# Altium project ADS131A04.PrjPcb
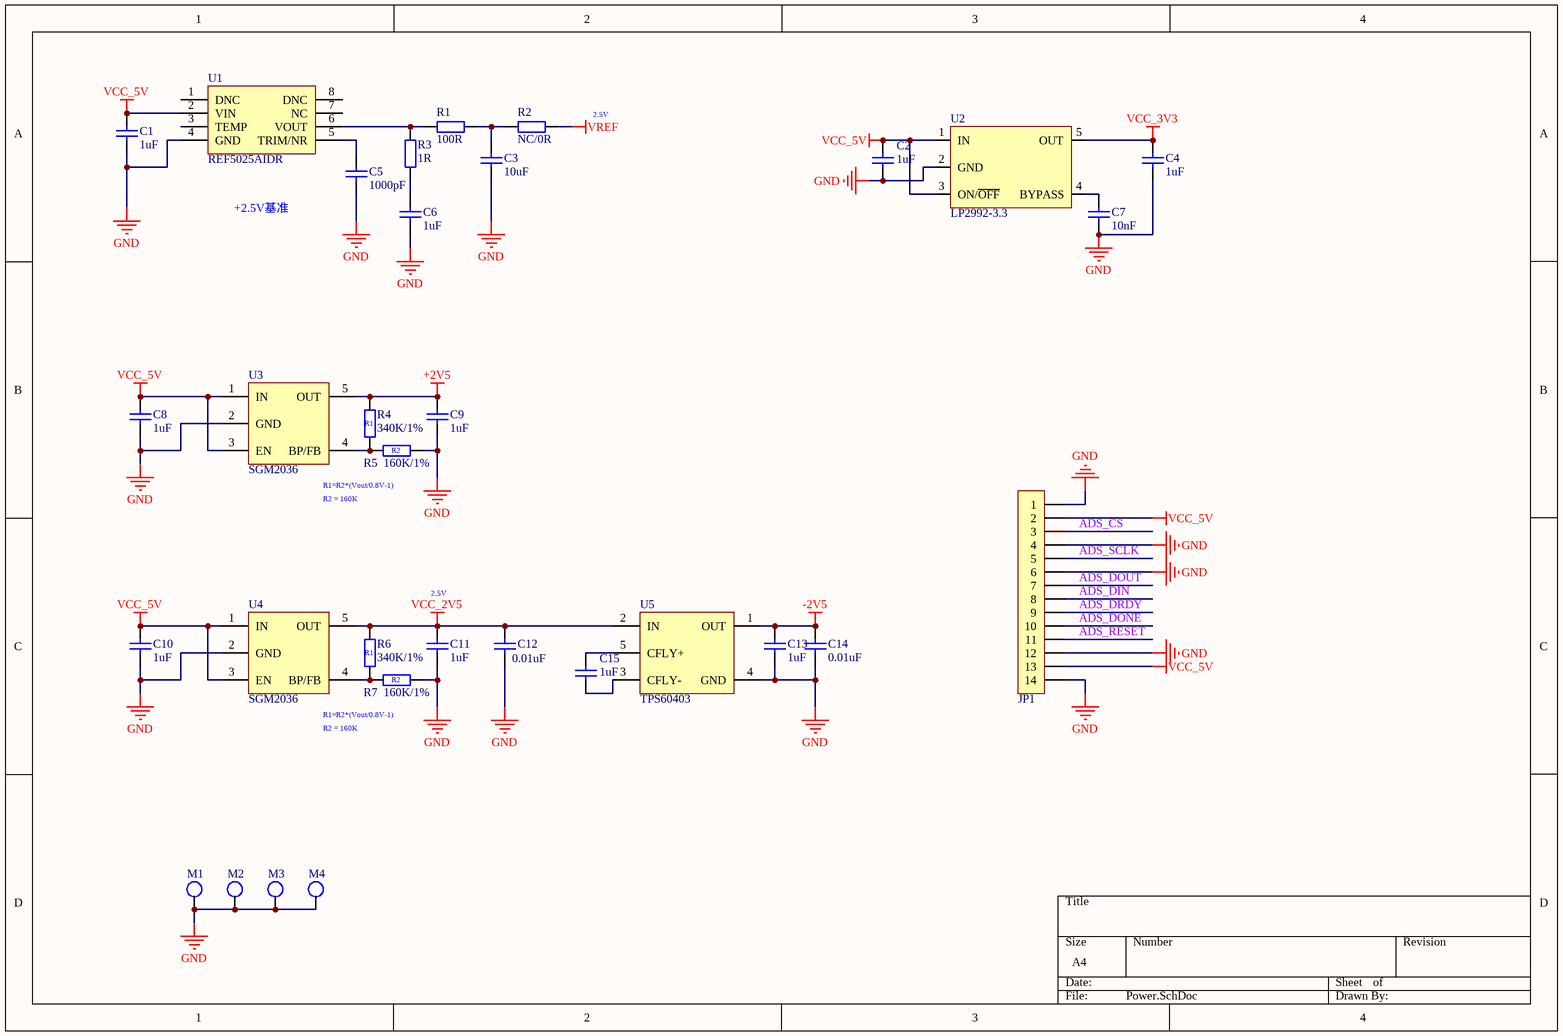
[diagram p0: Power.SchDoc]
2 sheets, 74 parts. Net scope: global (net labels, ports and power ports of the same name join across sheets).
Board files: ADS131A04.PcbDoc, 板框.PcbDoc
Sheets:
  Power.SchDoc
  ADS131A04.SchDoc

## Sheet Power.SchDoc
size A4; SheetNumber: 1; SheetTotal: 2

### Parts
C1  1uF  [C0402_L]
C2  1uF  [C0402_L]
C3  10uF  [C0603_L]
C4  1uF  [C0402_L]
C5  1000pF  [C0402_L]
C6  1uF  [C0402_L]
C7  10nF  [C0402_L]
C8  1uF  [C0402_L]
C9  1uF  [C0402_L]
C10  1uF  [C0402_L]
C11  1uF  [C0402_L]
C12  0.01uF  [C0402_L]
C13  1uF  [C0402_L]
C14  0.01uF  [C0402_L]
C15  1uF  [C0402_L]
JP1  HDR-1X14  [FPC0.5-WT-14P]  (value not drawn)
M1  M2  [M2]  (value not drawn)
M2  M2  [M2]  (value not drawn)
M3  M2  [M2]  (value not drawn)
M4  M2  [M2]  (value not drawn)
R1  100R  [R0402_L]
R2  NC/0R  [R0402_L]
R3  1R  [R0402_L]
R4  340K/1%  [R0402_L]
R5  160K/1%  [R0402_L]
R6  340K/1%  [R0402_L]
R7  160K/1%  [R0402_L]
U1  REF5025AIDR  [SOIC-8L]
U2  LP2992-3.3  [SOT23-5L]
U3  SGM2036  [SOT23-5L]
U4  SGM2036  [SOT23-5L]
U5  TPS60403  [SOT23-5L]

### Nets
+2V5: C9.2 R4.2 U3.5(OUT)
-2V5: C13.2 C14.2 U5.1(OUT)
GND: C1.1 C2.1 C3.1 C4.1 C5.1 C6.1 C7.1 C8.1 C9.1 C10.1 C11.1 C12.1 C13.1 C14.1 JP1.1 JP1.4 JP1.6 JP1.12 JP1.14 M1.1 M2.1 M3.1 M4.1 R5.2 R7.2 U1.4(GND) U2.2(GND) U3.2(GND) U4.2(GND) U5.4(GND)
VCC_2V5: C11.2 C12.2 R6.2 U4.5(OUT) U5.2(IN)
VCC_3V3: C4.2 U2.5(OUT)
VCC_5V: C1.2 C2.2 C8.2 C10.2 JP1.2 JP1.13 U1.2(VIN) U2.1(IN) U2.3(ON/~{OFF}) U3.1(IN) U3.3(EN) U4.1(IN) U4.3(EN)
VREF: R2.2
ADS_CS: JP1.3
ADS_DIN: JP1.8
ADS_DONE: JP1.10
ADS_DOUT: JP1.7
ADS_DRDY: JP1.9
ADS_RESET: JP1.11
ADS_SCLK: JP1.5
NetC3_2: C3.2 R1.2 R2.1
NetC5_2: C5.2 U1.5(TRIM/NR)
NetC6_2: C6.2 R3.1
NetC7_2: C7.2 U2.4(BYPASS)
NetC15_1: C15.1 U5.3(CFLY-)
NetC15_2: C15.2 U5.5(CFLY+)
NetR1_1: R1.1 R3.2 U1.6(VOUT)
NetR4_1: R4.1 R5.1 U3.4(BP/FB)
NetR6_1: R6.1 R7.1 U4.4(BP/FB)

Not connected (* = marked no-connect by the designer): U1 1(DNC) 3(TEMP) 7(NC) 8(DNC)

### Notes on the sheet
- (near R2) 2.5V
- +2.5V基准
- (near R4) R1
- (near R5) R2
- R1=R2*(Vout/0.8V-1)
- R2 = 160K
- (near R6) R1
- (near C11) 2.5V
- (near R7) R2

### Library data of the parts
C1-C15 = C: 贴片电容; BOM名称: 无极性贴片电容; 联系卖家，免费查找封装: 唯一出售店铺网址https://shop463601444.taobao.com
JP1 = Header 14: 14P接插件; 封装库来自淘宝卖家 ID：黄晶宝石: 其他店铺购入均为盗版假冒封装库; 联系卖家，免费查找封装: 唯一出售店铺网址https://shop463601444.taobao.com; BOM名称: 14P接插件
M1-M4 = M2系列: M2孔支撑柱
R1-R7 = R: 贴片电阻; 联系卖家，免费查找封装: 唯一出售店铺网址https://shop463601444.taobao.com; BOM名称: 贴片电阻
U1 = REF5025AIDR: 3uVpp/V噪声 3ppm/℃漂移 电压基准 0.05%
U2 = LP2992
U3 U4 = SGM2036: 可调LDO
U5 = TPS6040x: 非稳压60mA电荷泵电压逆变器

## Sheet ADS131A04.SchDoc
size A4; SheetNumber: 2; SheetTotal: 2
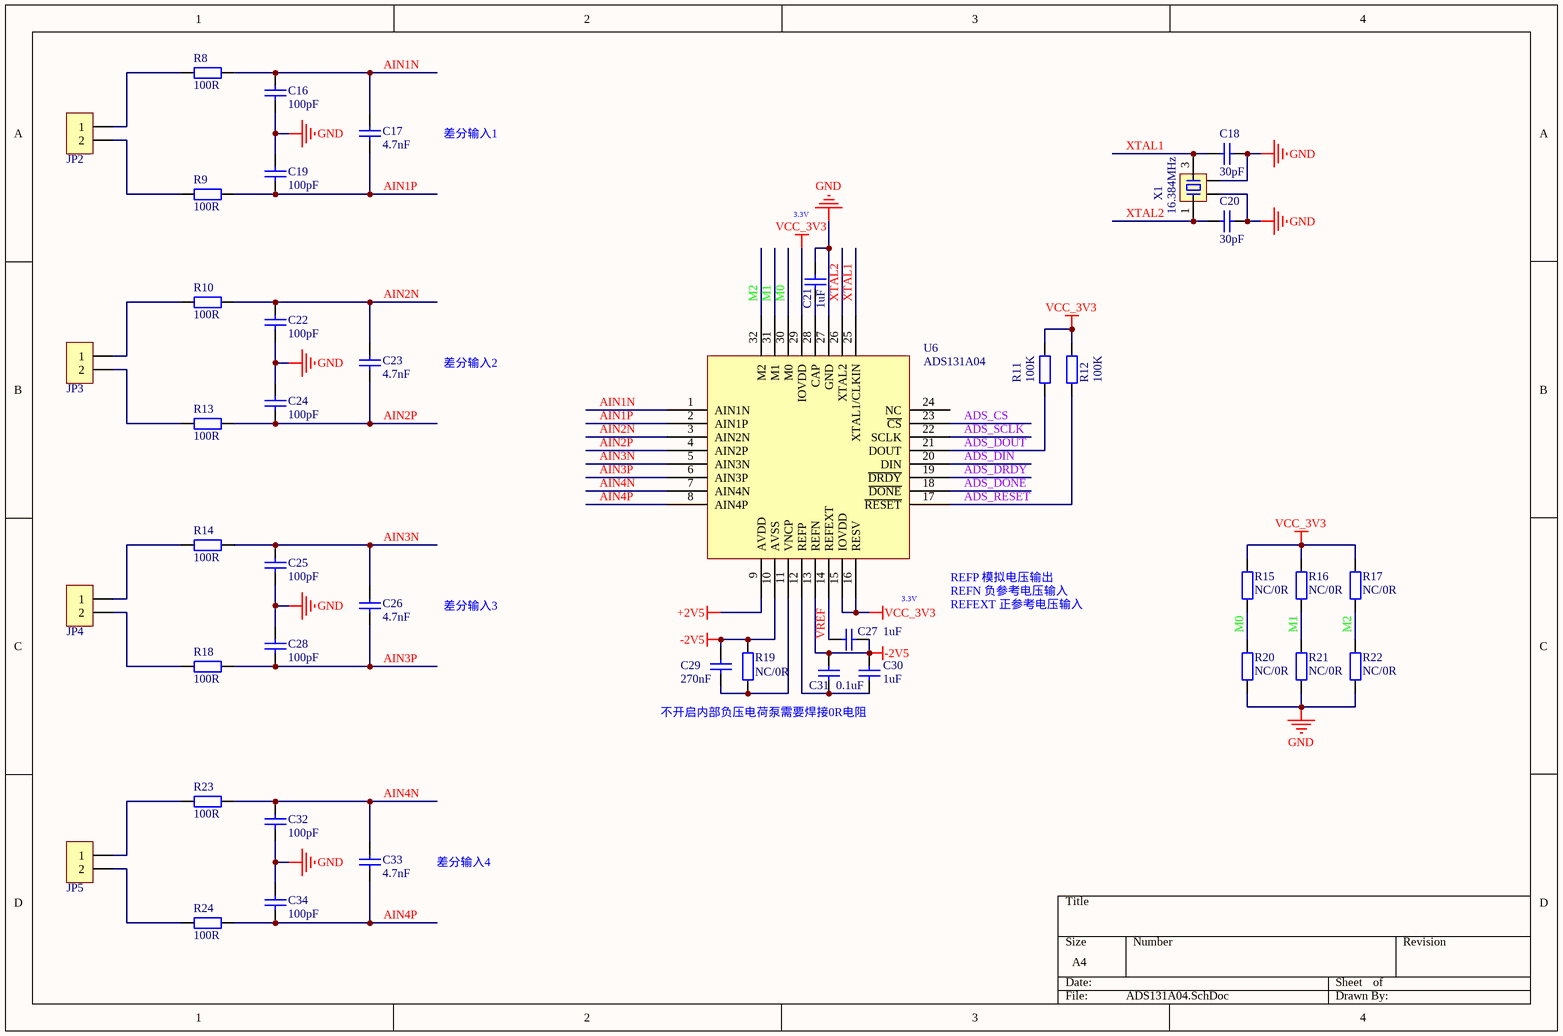
[diagram p1: ADS131A04.SchDoc]

### Parts
C16  100pF  [C0402_L]
C17  4.7nF  [C0402_L]
C18  30pF  [C0402_L]
C19  100pF  [C0402_L]
C20  30pF  [C0402_L]
C21  1uF  [C0402_L]
C22  100pF  [C0402_L]
C23  4.7nF  [C0402_L]
C24  100pF  [C0402_L]
C25  100pF  [C0402_L]
C26  4.7nF  [C0402_L]
C27  1uF  [C0402_L]
C28  100pF  [C0402_L]
C29  270nF  [C0402_L]
C30  1uF  [C0402_L]
C31  0.1uF  [C0402_L]
C32  100pF  [C0402_L]
C33  4.7nF  [C0402_L]
C34  100pF  [C0402_L]
JP2  HDR-1X2  [HDR2.54-WS-2P]  (value not drawn)
JP3  HDR-1X2  [HDR2.54-WS-2P]  (value not drawn)
JP4  HDR-1X2  [HDR2.54-WS-2P]  (value not drawn)
JP5  HDR-1X2  [HDR2.54-WS-2P]  (value not drawn)
R8  100R  [R0402_L]
R9  100R  [R0402_L]
R10  100R  [R0402_L]
R11  100K  [R0402_L]
R12  100K  [R0402_L]
R13  100R  [R0402_L]
R14  100R  [R0402_L]
R15  NC/0R  [R0402_L]
R16  NC/0R  [R0402_L]
R17  NC/0R  [R0402_L]
R18  100R  [R0402_L]
R19  NC/0R  [R0402_L]
R20  NC/0R  [R0402_L]
R21  NC/0R  [R0402_L]
R22  NC/0R  [R0402_L]
R23  100R  [R0402_L]
R24  100R  [R0402_L]
U6  ADS131A04  [TQFP32 5x5_L]
X1  16.384MHz  [XTAL-3225-4P]

### Nets
+2V5: U6.9(AVDD)
-2V5: C27.2 C29.2 C30.2 C31.2 R19.2 U6.10(AVSS) U6.13(REFN)
GND: C16.1 C18.2 C19.2 C20.2 C21.2 C22.1 C24.2 C25.1 C28.2 C32.1 C34.2 R20.1 R21.1 R22.1 U6.27(GND) X1.2 X1.4
VCC_3V3: R11.2 R12.2 R15.2 R16.2 R17.2 U6.15(IOVDD) U6.16(RESV) U6.29(IOVDD)
VREF: C27.1 U6.14(REFEXT)
ADS_CS: U6.23(~{CS})
ADS_DIN: U6.20(DIN)
ADS_DONE: U6.18(~{DONE})
ADS_DOUT: R11.1 U6.21(DOUT)
ADS_DRDY: U6.19(~{DRDY})
ADS_RESET: R12.1 U6.17(~{RESET})
ADS_SCLK: U6.22(SCLK)
AIN1N: C16.2 C17.2 R8.2 U6.1(AIN1N)
AIN1P: C17.1 C19.1 R9.2 U6.2(AIN1P)
AIN2N: C22.2 C23.2 R10.2 U6.3(AIN2N)
AIN2P: C23.1 C24.1 R13.2 U6.4(AIN2P)
AIN3N: C25.2 C26.2 R14.2 U6.5(AIN3N)
AIN3P: C26.1 C28.1 R18.2 U6.6(AIN3P)
AIN4N: C32.2 C33.2 R23.2 U6.7(AIN4N)
AIN4P: C33.1 C34.1 R24.2 U6.8(AIN4P)
M0: R15.1 R20.2 U6.30(M0)
M1: R16.1 R21.2 U6.31(M1)
M2: R17.1 R22.2 U6.32(M2)
XTAL1: C18.1 U6.25(XTAL1/CLKIN) X1.3
XTAL2: C20.1 U6.26(XTAL2) X1.1
NetC21_1: C21.1 U6.28(CAP)
NetC29_1: C29.1 R19.1 U6.11(VNCP)
NetC30_1: C30.1 C31.1 U6.12(REFP)
NetJP2_1: JP2.1 R8.1
NetJP2_2: JP2.2 R9.1
NetJP3_1: JP3.1 R10.1
NetJP3_2: JP3.2 R13.1
NetJP4_1: JP4.1 R14.1
NetJP4_2: JP4.2 R18.1
NetJP5_1: JP5.1 R23.1
NetJP5_2: JP5.2 R24.1

Not connected (* = marked no-connect by the designer): U6 24(NC)

### Notes on the sheet
- 差分输入1
- 3.3V
- 差分输入2
- (near U6) REFP 模拟电压输出
- 差分输入3
- (near U6) 3.3V
- (near U6) REFN 负参考电压输入
- REFEXT 正参考电压输入
- 不开启内部负压电荷泵需要焊接0R电阻
- 差分输入4

### Library data of the parts
C16-C34 = C: as C1 on sheet Power
JP2-JP5 = Header 2: 2P接插件; 封装库来自淘宝卖家 ID：黄晶宝石: 其他店铺购入均为盗版假冒封装库; 联系卖家，免费查找封装: 唯一出售店铺网址https://shop463601444.taobao.com; BOM名称: 2P接插件
R8-R24 = R: as R1 on sheet Power; BOM名称: 贴片电阻
U6 = ADS131A04: 4通道差分24位ADC
X1 = XTAL-4P: 4脚无源晶振(谐振器）; 联系卖家，免费查找封装: 唯一出售店铺网址https://shop463601444.taobao.com; BOM名称: 4脚无源晶振(谐振器）

## Nets that join several sheets
+2V5: Power (C9.2 R4.2 U3.5), ADS131A04 (U6.9)
-2V5: Power (C13.2 C14.2 U5.1), ADS131A04 (7 pins)
GND: Power (30 pins), ADS131A04 (17 pins)
VCC_3V3: Power (C4.2 U2.5), ADS131A04 (8 pins)
VREF: Power (R2.2), ADS131A04 (C27.1 U6.14)
ADS_CS: Power (JP1.3), ADS131A04 (U6.23)
ADS_DIN: Power (JP1.8), ADS131A04 (U6.20)
ADS_DONE: Power (JP1.10), ADS131A04 (U6.18)
ADS_DOUT: Power (JP1.7), ADS131A04 (R11.1 U6.21)
ADS_DRDY: Power (JP1.9), ADS131A04 (U6.19)
ADS_RESET: Power (JP1.11), ADS131A04 (R12.1 U6.17)
ADS_SCLK: Power (JP1.5), ADS131A04 (U6.22)